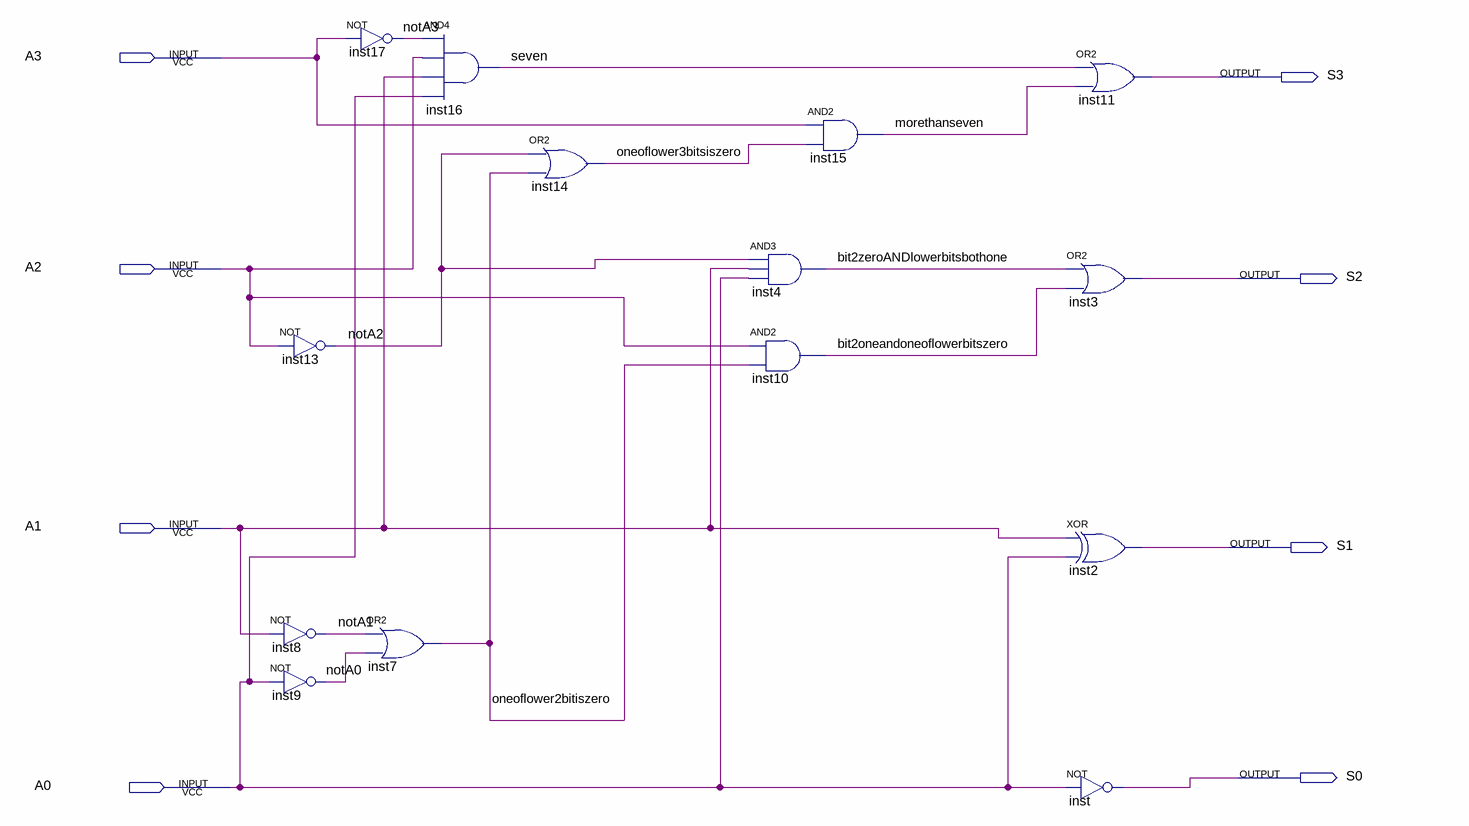
[diagram p0: schematic sheet]
// Quartus schematic INC4.bdf as structural Verilog: 14 symbols, 8 pins
module INC4 (
  input  A3,
  input  A2,
  input  A1,
  input  A0,
  output S3,
  output S2,
  output S1,
  output S0
);

  wire bit2oneandoneoflowerbitszero, bit2zeroANDlowerbitsbothone, morethanseven, notA0, notA1, notA2, notA3,
       oneoflower2bitiszero, oneoflower3bitsiszero, seven;

  not inst8 (notA1, A1);
  not inst9 (notA0, A0);
  not inst17 (notA3, A3);
  not inst13 (notA2, A2);
  and inst16 (seven, notA3, A2, A1, A0);
  or inst7 (oneoflower2bitiszero, notA1, notA0);
  or inst14 (oneoflower3bitsiszero, notA2, oneoflower2bitiszero);
  and inst15 (morethanseven, A3, oneoflower3bitsiszero);
  and inst4 (bit2zeroANDlowerbitsbothone, notA2, A1, A0);
  and inst10 (bit2oneandoneoflowerbitszero, A2, oneoflower2bitiszero);
  or inst11 (S3, seven, morethanseven);
  or inst3 (S2, bit2zeroANDlowerbitsbothone, bit2oneandoneoflowerbitszero);
  xor inst2 (S1, A1, A0);
  not inst (S0, A0);
endmodule
